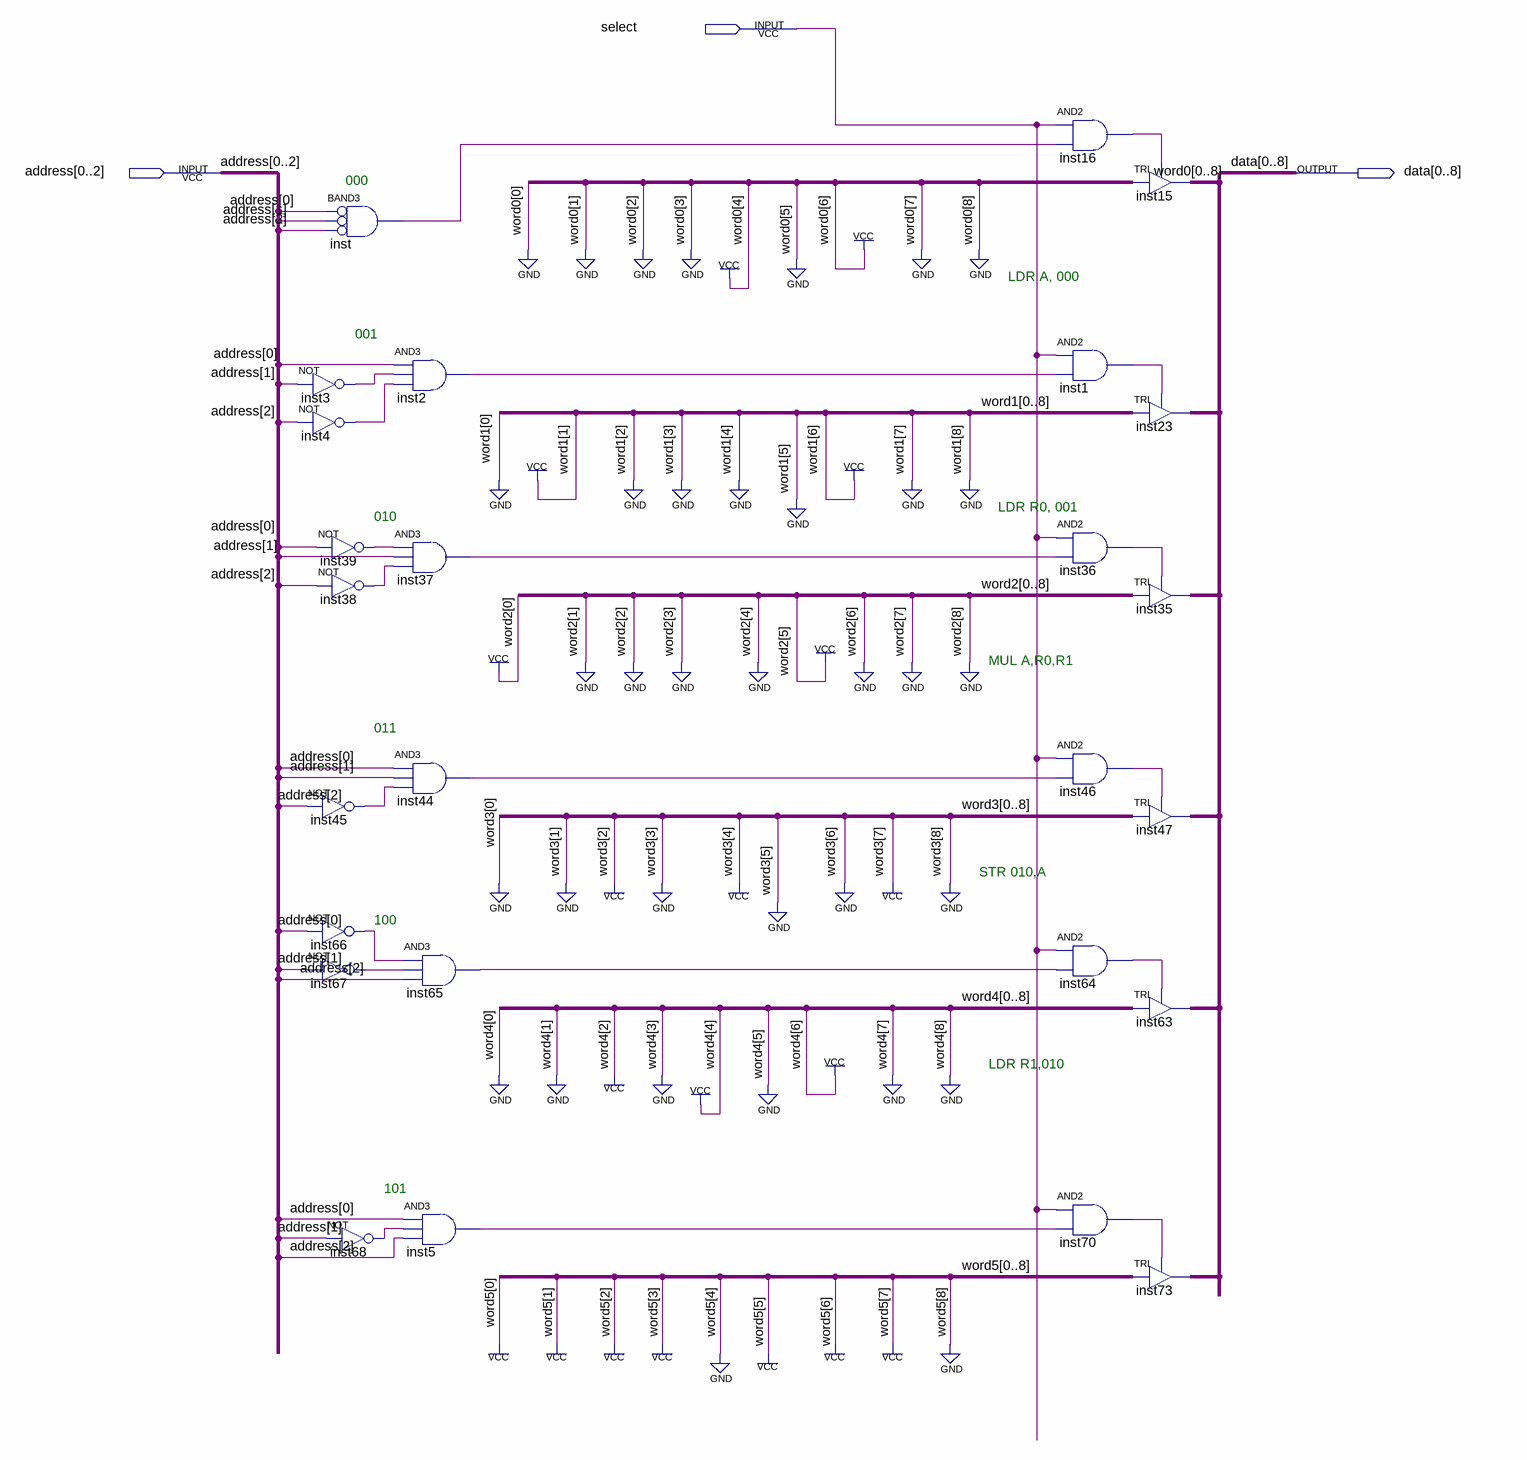
[diagram p0: schematic sheet]
// Quartus schematic instruction_mem.bdf as structural Verilog: 26 symbols, 3 pins
module instruction_mem (
  input  select,
  input  [0:2] address,
  output [0:8] data
);

  wire inst1_out, inst2_out, inst3_out, inst4_out, inst5_out, inst16_out, inst36_out, inst37_out, inst38_out,
       inst39_out, inst44_out, inst45_out, inst46_out, inst64_out, inst65_out, inst66_out, inst67_out,
       inst68_out, inst70_out, inst_out;

  not inst3 (inst3_out, address[1]);
  not inst4 (inst4_out, address[2]);
  not inst39 (inst39_out, address[0]);
  not inst38 (inst38_out, address[2]);
  not inst45 (inst45_out, address[2]);
  not inst66 (inst66_out, address[0]);
  not inst67 (inst67_out, address[1]);
  and inst (inst_out, ~address[0], ~address[1], ~address[2]);  // BAND3
  and inst2 (inst2_out, address[0], inst3_out, inst4_out);
  and inst37 (inst37_out, inst39_out, address[1], inst38_out);
  and inst44 (inst44_out, address[0], address[1], inst45_out);
  not inst68 (inst68_out, address[1]);
  and inst65 (inst65_out, inst66_out, inst67_out, address[2]);
  and inst5 (inst5_out, address[0], inst68_out, address[2]);
  and inst16 (inst16_out, select, inst_out);
  and inst1 (inst1_out, select, inst2_out);
  and inst36 (inst36_out, select, inst37_out);
  and inst46 (inst46_out, select, inst44_out);
  and inst64 (inst64_out, select, inst65_out);
  and inst70 (inst70_out, select, inst5_out);
  TRI inst15[8:0] (.IN(9'b000010100), .OE(inst16_out), .OUT(data));
  TRI inst23[8:0] (.IN(9'b010000100), .OE(inst1_out), .OUT(data));
  TRI inst35[8:0] (.IN(9'b100001000), .OE(inst36_out), .OUT(data));
  TRI inst47[8:0] (.IN(9'b001010010), .OE(inst46_out), .OUT(data));
  TRI inst63[8:0] (.IN(9'b001010100), .OE(inst64_out), .OUT(data));
  TRI inst73[8:0] (.IN(9'b111101110), .OE(inst70_out), .OUT(data));

  // Notes on the sheet:
  //   000
  //   LDR A, 000
  //   001
  //   LDR R0, 001
  //   010
  //   MUL A,R0,R1
  //   011
  //   STR 010,A
  //   100
  //   LDR R1,010
  //   101
endmodule
